# Altium schematic sheet LCDTFT_FPC50P_RGB.SchDoc
size A3; SheetNumber: 13; SheetTotal: 27
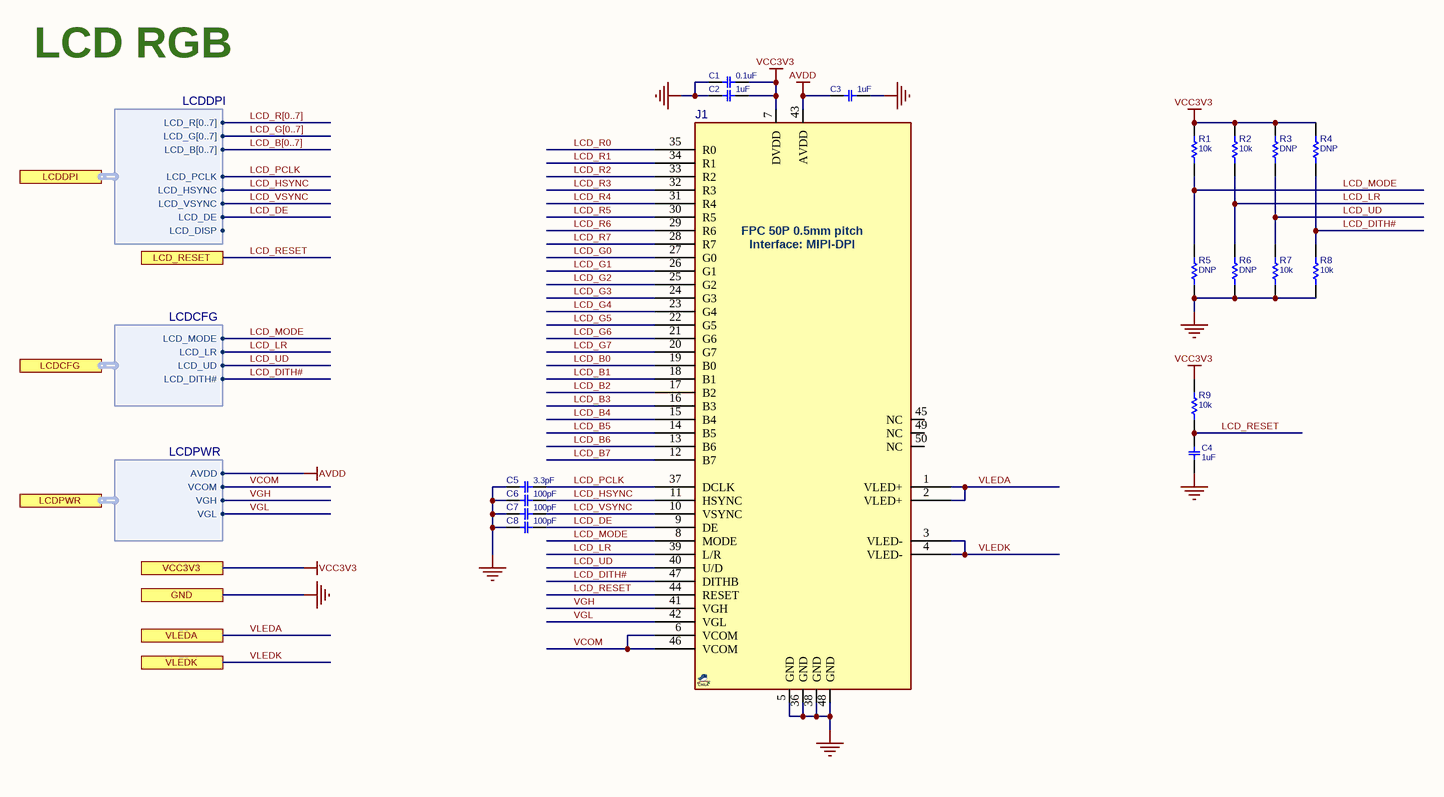
[diagram p0: LCDTFT_FPC50P_RGB.SchDoc]

## Parts
C1  0.1uF  [C0402]
C2  1uF  [C0402]
C3  1uF  [C0402]
C4  1uF  [C0402]
C5  3.3pF  [C0402]
C6  100pF  [C0402]
C7  100pF  [C0402]
C8  100pF  [C0402]
J1  FPC_50_0.5mm  [FPC50_50D_FFC2B29]  (value not drawn)
R1  10k  [R0402]
R2  10k  [R0402]
R3  DNP  [R0402]
R4  DNP  [R0402]
R5  DNP  [R0402]
R6  DNP  [R0402]
R7  10k  [R0402]
R8  10k  [R0402]
R9  10k  [R0402]

## Ports
GND, LCD_RESET, LCDCFG (harness LCDCFG), LCDDPI (harness LCDDPI), LCDPWR (harness LCDPWR), VCC3V3, VLEDA, VLEDK

## Harnesses
LCDDPI: LCD_PCLK, LCD_HSYNC, LCD_VSYNC, LCD_DE, LCD_R[0..7], LCD_G[0..7], LCD_B[0..7], LCD_DISP
LCDPWR: AVDD, VGH, VCOM, VGL
LCDCFG: LCD_MODE, LCD_LR, LCD_UD, LCD_DITH#

## Nets
AVDD: C3.2 J1.43(AVDD) ; port LCDPWR.AVDD
GND: C1.2 C2.2 C3.1 C4.2 C5.2 C6.2 C7.2 C8.2 J1.5(GND) J1.36(GND) J1.38(GND) J1.48(GND) R5.2 R6.2 R7.2 R8.2 ; port GND
VCC3V3: C1.1 C2.1 J1.7(DVDD) R1.1 R2.1 R3.1 R4.1 R9.1 ; port VCC3V3
LCD_B0: J1.19(B0)
LCD_B1: J1.18(B1)
LCD_B2: J1.17(B2)
LCD_B3: J1.16(B3)
LCD_B4: J1.15(B4)
LCD_B5: J1.14(B5)
LCD_B6: J1.13(B6)
LCD_B7: J1.12(B7)
LCD_DE: C8.1 J1.9(DE) ; port LCDDPI.LCD_DE
LCD_DITH#: J1.47(DITHB) R4.2 R8.1 ; port LCDCFG.LCD_DITH#
LCD_G0: J1.27(G0)
LCD_G1: J1.26(G1)
LCD_G2: J1.25(G2)
LCD_G3: J1.24(G3)
LCD_G4: J1.23(G4)
LCD_G5: J1.22(G5)
LCD_G6: J1.21(G6)
LCD_G7: J1.20(G7)
LCD_HSYNC: C6.1 J1.11(HSYNC) ; port LCDDPI.LCD_HSYNC
LCD_LR: J1.39(L/R) R2.2 R6.1 ; port LCDCFG.LCD_LR
LCD_MODE: J1.8(MODE) R1.2 R5.1 ; port LCDCFG.LCD_MODE
LCD_PCLK: C5.1 J1.37(DCLK) ; port LCDDPI.LCD_PCLK
LCD_R0: J1.35(R0)
LCD_R1: J1.34(R1)
LCD_R2: J1.33(R2)
LCD_R3: J1.32(R3)
LCD_R4: J1.31(R4)
LCD_R5: J1.30(R5)
LCD_R6: J1.29(R6)
LCD_R7: J1.28(R7)
LCD_RESET: C4.1 J1.44(RESET) R9.2 ; port LCD_RESET
LCD_UD: J1.40(U/D) R3.2 R7.1 ; port LCDCFG.LCD_UD
LCD_VSYNC: C7.1 J1.10(VSYNC) ; port LCDDPI.LCD_VSYNC
VCOM: J1.6(VCOM) J1.46(VCOM) ; port LCDPWR.VCOM
VGH: J1.41(VGH) ; port LCDPWR.VGH
VGL: J1.42(VGL) ; port LCDPWR.VGL
VLEDA: J1.1(VLED+) J1.2(VLED+) ; port VLEDA
VLEDK: J1.3(VLED-) J1.4(VLED-) ; port VLEDK

Not connected (* = marked no-connect by the designer): J1 45(NC) 49(NC) 50(NC)

## Buses and harness runs
bus LCD_B[0..7]
bus LCD_G[0..7]
bus LCD_R[0..7]

## Notes on the sheet
- LCD RGB
- (in symbol LCDTFT_DPI_FPC50P) FPC 50P 0.5mm pitch; Interface: MIPI-DPI

## Library data of the parts
C1 = CAP_SMD_MLCC: CAP, MLCC; PARAM: X7R, 10%, -55~125oC; MANF_P#: GRM155R71H104KE14D; MANF: Murata; PARAM2: 50v; PRICE: 100: 0.018$; ASSEMBLY: ASSEMBLY; VALUE: 0.1uF
C2-C4 = CAP_SMD_MLCC: CAP, MLCC; PARAM: X5R, 10%; MANF_P#: CL05A105KO5NNND; MANF: Samsung; PARAM2: 16v; PRICE: 50,000:	$0.006; ASSEMBLY: ASSEMBLY; VALUE: 1uF
C5-C8 = CAP_SMD_MLCC: CAP, MLCC; PARAM: X5R, 10%; PARAM2: 50v; PRICE: 50,000:	$0.006; MANF_P#: -; MANF: -; ASSEMBLY: ASSEMBLY
  C5: VALUE: 3.3pF
  C6-C8: VALUE: 100pF
J1 = LCDTFT_DPI_FPC50P: LCD TFT Color, FPC50P, RGB; MANF: -; MANF_P#: -; PARAM: -; VALUE: FPC_50_0.5mm
R1-R9 = RES_SMD: RESISTOR, SMD; PARAM: 0.063W; DESC: DESCRIPTION; DIST#: MOUSER; PARAM2: 1%; MANF_P#: -; MANF: -; ASSEMBLY: ASSEMBLY; PRICE: 100= 0.3$
  R1 R2 R7-R9: VALUE: 10k
  R3-R6: VALUE: DNP